# EAGLE design PSU (EAGLE 6.3)
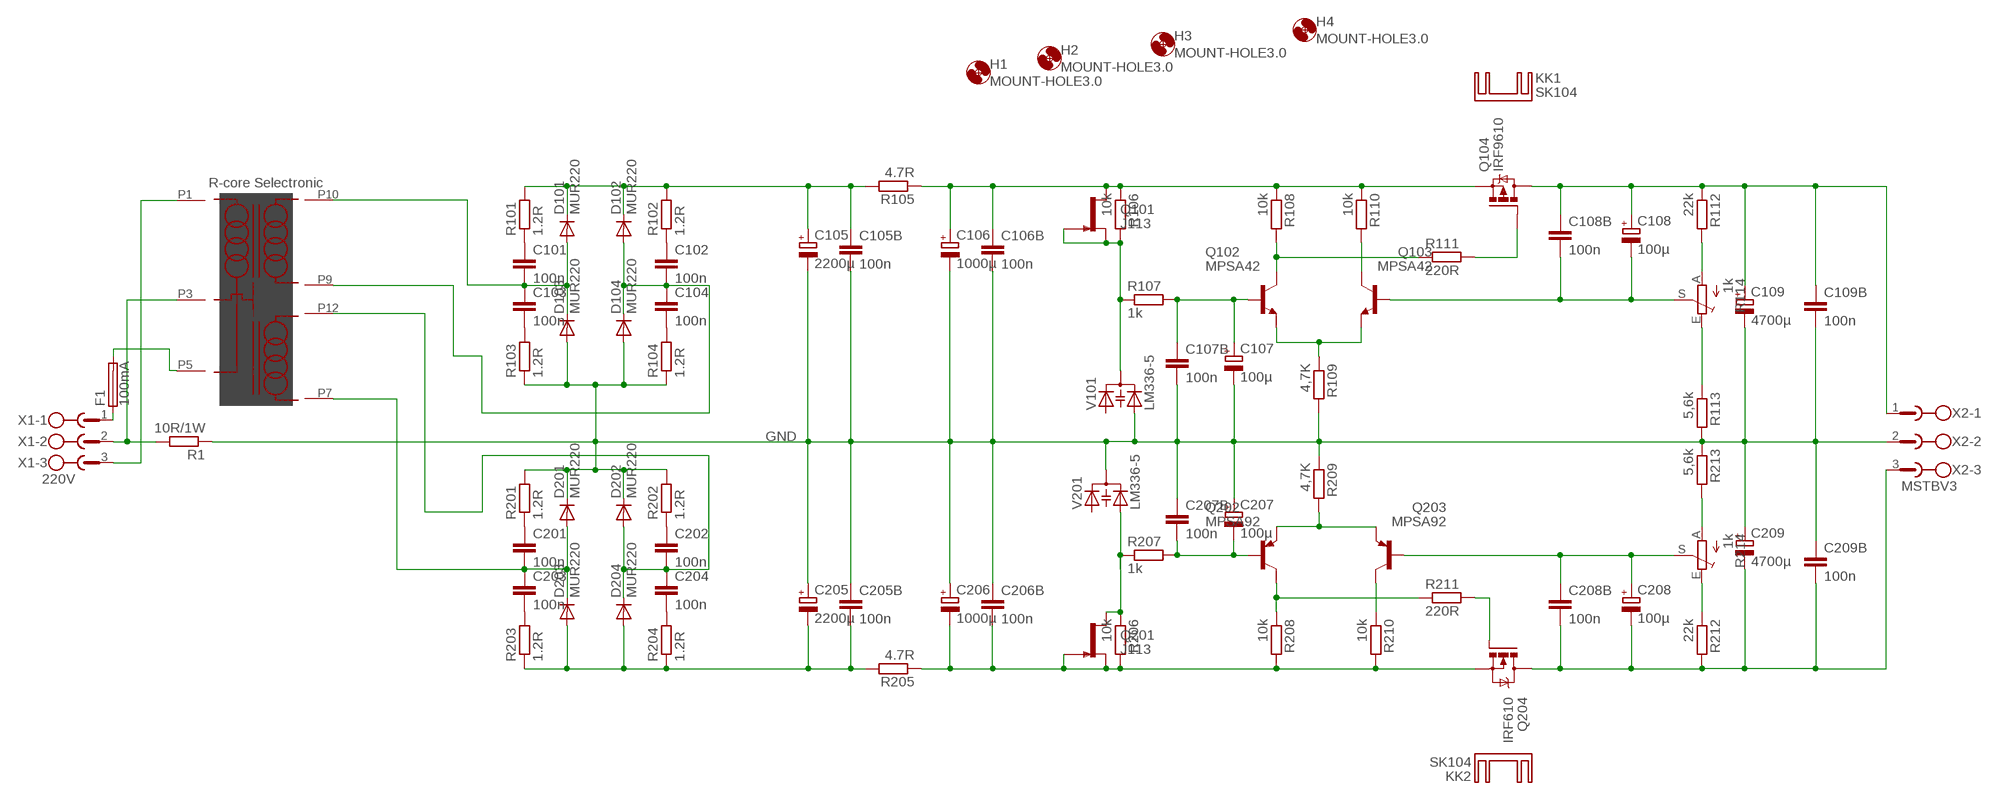
[diagram p0: schematic, sheet 1]

## Parts
C101  100n  C-EU050-025X075  [C050-025X075]
C102  100n  C-EU050-025X075  [C050-025X075]
C103  100n  C-EU050-025X075  [C050-025X075]
C104  100n  C-EU050-025X075  [C050-025X075]
C105  2200µ  CPOL-EUE7.5-16  [E7,5-16]
C105B  100n  C-EU050-025X075  [C050-025X075]
C106  1000µ  CPOL-EUE7.5-16  [E7,5-16]
C106B  100n  C-EU050-025X075  [C050-025X075]
C107  100µ  CPOL-EUE5-10.5  [E5-10,5]
C107B  100n  C-EU050-025X075  [C050-025X075]
C108  100µ  CPOL-EUE5-10.5  [E5-10,5]
C108B  100n  C-EU050-025X075  [C050-025X075]
C109  4700µ  CPOL-EUE10-25  [EB25D]
C109B  100n  C-EU050-025X075  [C050-025X075]
C201  100n  C-EU050-025X075  [C050-025X075]
C202  100n  C-EU050-025X075  [C050-025X075]
C203  100n  C-EU050-025X075  [C050-025X075]
C204  100n  C-EU050-025X075  [C050-025X075]
C205  2200µ  CPOL-EUE7.5-16  [E7,5-16]
C205B  100n  C-EU050-025X075  [C050-025X075]
C206  1000µ  CPOL-EUE7.5-16  [E7,5-16]
C206B  100n  C-EU050-025X075  [C050-025X075]
C207  100µ  CPOL-EUE5-10.5  [E5-10,5]
C207B  100n  C-EU050-025X075  [C050-025X075]
C208  100µ  CPOL-EUE5-10.5  [E5-10,5]
C208B  100n  C-EU050-025X075  [C050-025X075]
C209  4700µ  CPOL-EUE10-25  [EB25D]
C209B  100n  C-EU050-025X075  [C050-025X075]
D101  MUR220  BY500  [DO201-15]
D102  MUR220  BY500  [DO201-15]
D103  MUR220  BY500  [DO201-15]
D104  MUR220  BY500  [DO201-15]
D201  MUR220  BY500  [DO201-15]
D202  MUR220  BY500  [DO201-15]
D203  MUR220  BY500  [DO201-15]
D204  MUR220  BY500  [DO201-15]
F1  100mA  GSH15  [GSH15]
H1  MOUNT-HOLE3.0  [3,0]
H2  MOUNT-HOLE3.0  [3,0]
H3  MOUNT-HOLE3.0  [3,0]
H4  MOUNT-HOLE3.0  [3,0]
KK1  SK104  [SK104]
KK2  SK104  [SK104]
Q101  J113  2N5458  [TO-92]
Q102  MPSA42  -NPN-TO92-EBC  [TO92-EBC]
Q103  MPSA42  -NPN-TO92-EBC  [TO92-EBC]
Q104  IRF9610  IRF9530  [TO220BV]
Q201  J113  2N5458  [TO-92]
Q202  MPSA92  BCX58-PNP-TO92-EBC  [TO92-EBC]
Q203  MPSA92  BCX58-PNP-TO92-EBC  [TO92-EBC]
Q204  IRF610  IRF740  [TO220BV]
R1  10R/1W  R-EU_0613/15  [P0613/15]
R101  1.2R  R-EU_0207/10  [0207/10]
R102  1.2R  R-EU_0207/10  [0207/10]
R103  1.2R  R-EU_0207/10  [0207/10]
R104  1.2R  R-EU_0207/10  [0207/10]
R105  4.7R  R-EU_0207/10  [0207/10]
R106  10k  R-EU_0207/10  [0207/10]
R107  1k  R-EU_0207/10  [0207/10]
R108  10k  R-EU_0207/10  [0207/10]
R109  4,7K  R-EU_0207/10  [0207/10]
R110  10k  R-EU_0207/10  [0207/10]
R111  220R  R-EU_0207/10  [0207/10]
R112  22k  R-EU_0207/10  [0207/10]
R113  5,6k  R-EU_0207/10  [0207/10]
R114  1k  TRIM_EU-S64W  [S64W]
R201  1.2R  R-EU_0207/10  [0207/10]
R202  1.2R  R-EU_0207/10  [0207/10]
R203  1.2R  R-EU_0207/10  [0207/10]
R204  1.2R  R-EU_0207/10  [0207/10]
R205  4.7R  R-EU_0207/10  [0207/10]
R206  10k  R-EU_0207/10  [0207/10]
R207  1k  R-EU_0207/10  [0207/10]
R208  10k  R-EU_0207/10  [0207/10]
R209  4,7K  R-EU_0207/10  [0207/10]
R210  10k  R-EU_0207/10  [0207/10]
R211  220R  R-EU_0207/10  [0207/10]
R212  22k  R-EU_0207/10  [0207/10]
R213  5,6k  R-EU_0207/10  [0207/10]
R214  1k  TRIM_EU-S64W  [S64W]
U$1  R-CORE-SELECTRONIC-PCB  [R-CORE48MM]
V101  LM336-5  DIODE-2CAPACITANCESOT54E  [SOT54E]
V201  LM336-5  DIODE-2CAPACITANCESOT54E  [SOT54E]
X1  220V  MSTBV3  [MSTBV3]
X2  MSTBV3  [MSTBV3]

## Nets
GND [power]: C105.- C105B.2 C106.- C106B.2 C107.- C107B.2 C109.- C109B.2 C205.+ C205B.1 C206.+ C206B.1 C207.+ C207B.1 C209.+ C209B.1 D103.A D104.A D201.C D202.C R1.1 R103.1 R104.1 R109.2 R113.2 R201.2 R202.2 R209.1 R213.1 V101.A2 V201.C X2.2
N$1 [power]: C101.2 C103.1 D101.A D103.C U$1.P10(SEC2-10)
N$2 [power]: C102.2 C104.1 D102.A D104.C U$1.P9(SEC2-9)
N$3: C102.1 R102.1
N$4: C103.2 R103.2
N$5 [power]: C106.+ C106B.1 Q101.1(D) Q104.S R105.1 R106.1 R108.1 R110.1
N$6: C101.1 R101.1
N$7: C104.2 R104.2
N$8 [power]: C105.+ C105B.1 D101.C D102.C R101.2 R102.2 R105.2
N$9 [power]: C206.- C206B.2 Q201.2(S) Q201.3(G) Q204.S R205.1 R206.2 R208.2 R210.2
N$10 [power]: C201.2 C203.1 D201.A D203.C U$1.P7(SEC1-7)
N$11 [power]: C202.2 C204.1 D202.A D204.C U$1.P12(SEC1-12)
N$12: C201.1 R201.1
N$13: C202.1 R202.1
N$14: C203.2 R203.2
N$15: C204.2 R204.2
N$16 [power]: C208.- C208B.2 C209.- C209B.2 Q204.D R212.2 X2.3
N$17 [power]: C205.- C205B.2 D203.A D204.A R203.1 R204.1 R205.2
N$18 [Mains]: F1.1 X1.1
N$19: Q201.1(D) R206.1 R207.1 V201.A2
N$20: Q104.G R111.2
N$21: Q102.C R108.2 R111.1
N$22: Q202.C R208.1 R211.1
N$23: C107.+ C107B.1 Q102.B R107.2
N$24: C207.- C207B.2 Q202.B R207.2
N$25: Q103.C R110.2
N$26: Q102.E Q103.E R109.1
N$27: Q202.E Q203.E R209.2
N$28: Q203.C R210.1
N$29 [power]: C108.+ C108B.1 C109.+ C109B.1 Q104.D R112.1 X2.1
N$30: Q101.2(S) Q101.3(G) R106.2 R107.1 V101.C
N$31: Q204.G R211.2
N$32: C108.- C108B.2 Q103.B R114.S
N$33: C208.+ C208B.1 Q203.B R214.S
N$34: R112.2 R114.A
N$35: R113.1 R114.E
N$36: R212.1 R214.E
N$37: R213.2 R214.A
N$38 [Mains]: F1.2 U$1.P5(PRIM5)
N$40 [Mains]: U$1.P1(PRIM-1) X1.3
N$41 [power]: R1.2 U$1.P3(SHIELD3) X1.2
Unconnected: V101.A1 V201.A1

## Library data of the parts
C101-C104 C105B C106B C107B C108B C109B C201-C204 C205B C206B C207B C208B C209B = rcl:C-EU: CAPACITOR, European symbol
C105-C109 C205-C209 = rcl:CPOL-EU: POLARIZED CAPACITOR, European symbol
D101-D104 D201-D204 = diode:BY500: DIODE fast recovery diode, 5 A, 800 V
F1 = fuse:GSH15: FUSE HOLDER grid 15mm, 19649 Wickmann; MPN: 64900001039; OC_FARNELL: 1271673; OC_NEWARK: 02P0318
H1-H4 = holes:MOUNT-HOLE: MOUNTING HOLE with drill center marker
KK1 KK2 = heatsink:SK104: HEATSINK manufacturer Fischer/distributor Buerklin
Q101 Q201 = 00_steve:2N5458
Q102 Q103 = transistor:*-NPN-: NPN Transistror BF959 corrected 2008.03.06
Q104 = transistor-power:IRF9530: P-CHANNEL HEXFET POWER-MOS-FET Source: http://www.irf.com/product-info/datasheets/data/irf9530.pdf
Q202 Q203 = transistor:*-PNP-: PNP Transistror
Q204 = transistor-power:IRF740: N-CHANNEL MOS FET
R1 R101-R113 R201-R213 = rcl:R-EU_: RESISTOR, European symbol
R114 R214 = pot:TRIM_EU-: POTENTIOMETER
U$1 = gael:R-CORE-SELECTRONIC-PCB: Transformateurs R-core pour PCB vendus par Selectronic (GAJ)
V101 V201 = diode:DIODE-2CAPACITANCE: Capacity DIODE variable-capacitance diode (Infineon)
X1 X2 = con-phoenix-508:MSTBV3: PHOENIX; MPN: MSTBV 2,5/3-GF-5.08; OC_FARNELL: 1792793; OC_NEWARK: 69R9846

## Net classes
0 default: width 0.508 mm, clearance 0.203 mm
1 Mains: width 1.016 mm, clearance 2.5 mm
2 power: width 0.508 mm, clearance 0.203 mm

## Board
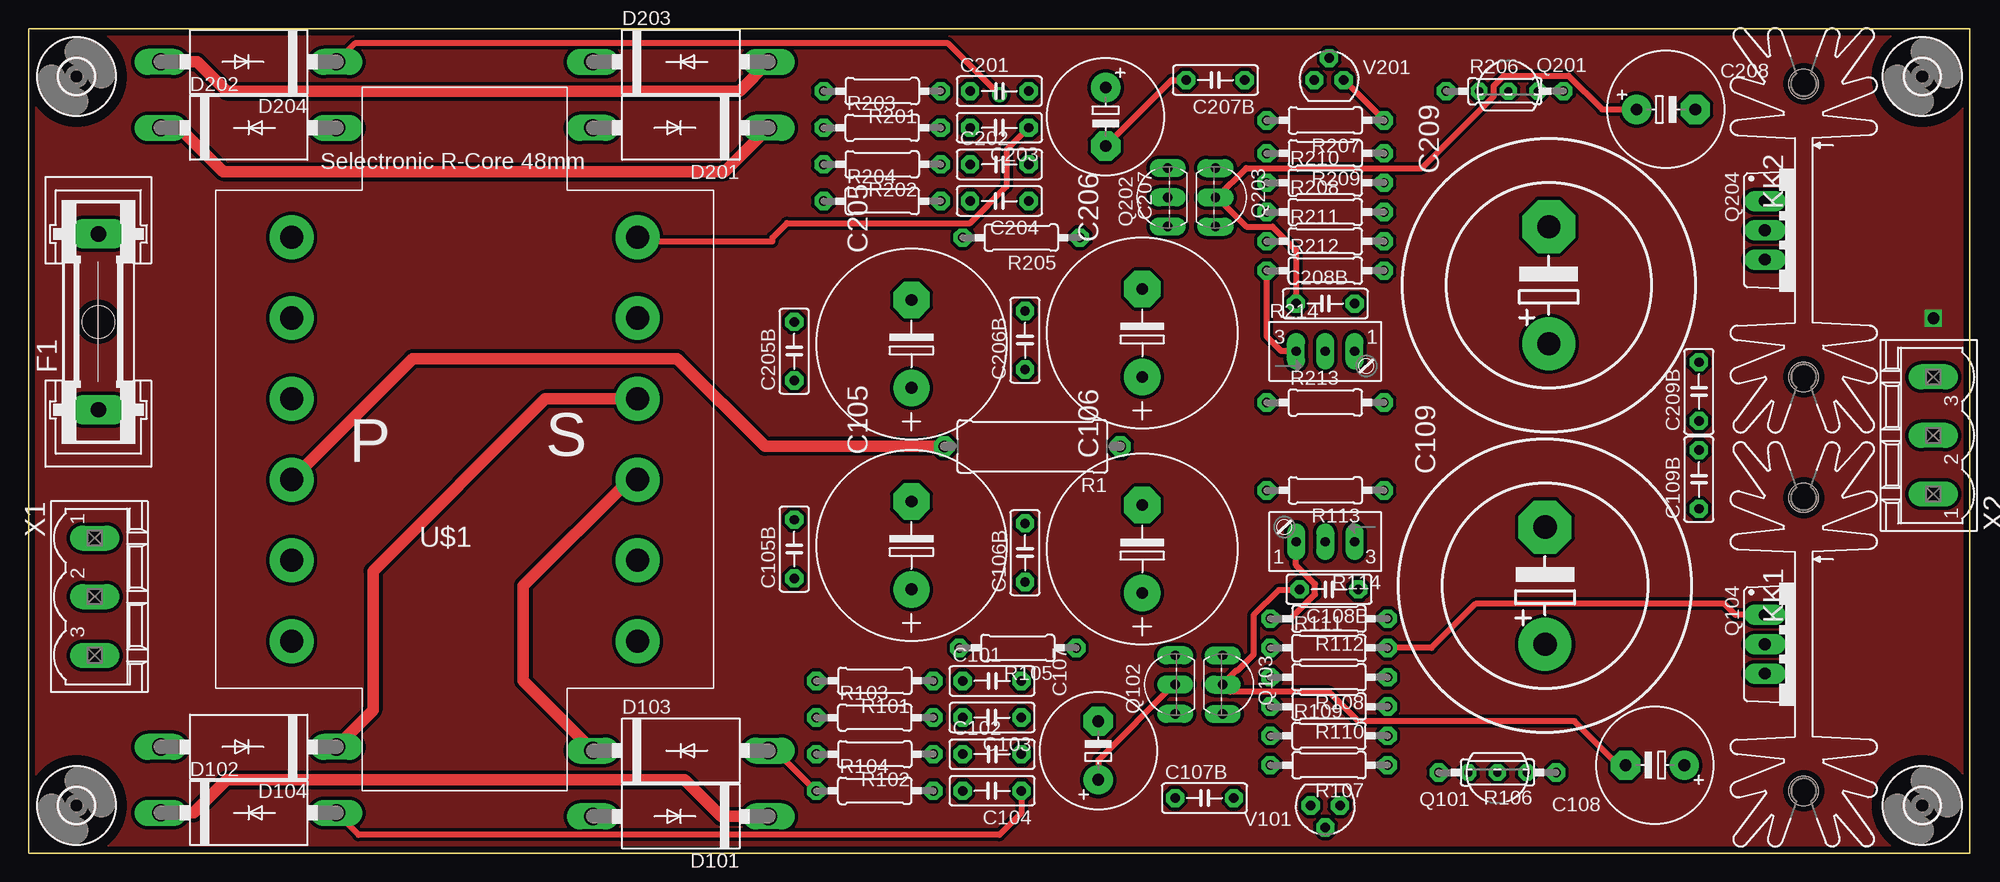
[diagram p1: board, top side]
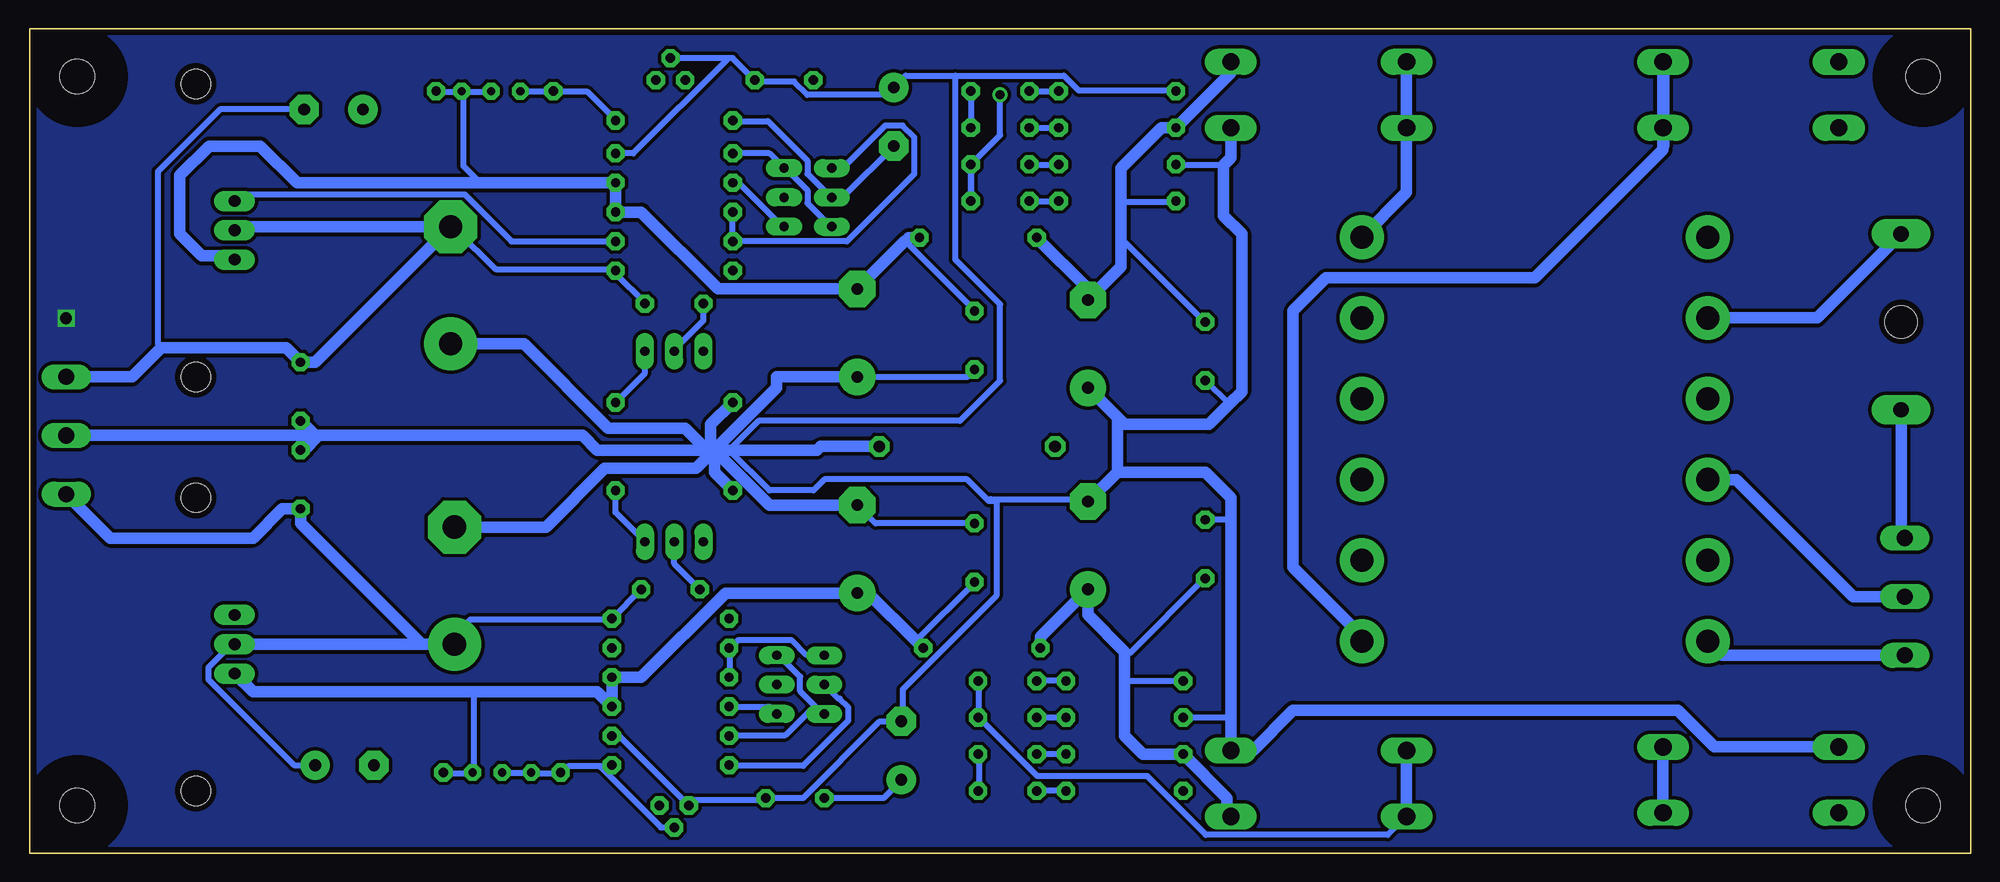
[diagram p2: board, bottom side, seen from below]

Size 168.28 x 71.44 mm. Coordinates in mm from the lower left corner, seen from the top.
Outline: 168.28,0 0,0 0,71.44 168.28,71.44 168.28,0
Copper layers (1*16): Top 0.035mm / dielectric 1.5mm / Bottom 0.035mm
Design rules "gael design rules": minimum track width 12mil, minimum drill 24mil, track to track 8mil, track to pad 8mil, pad to pad 8mil, via to via 8mil, smd to smd 8mil, copper to edge 20mil, drill to drill 8mil, minimum pad ring 15mil, minimum via ring 10mil, stop-mask expansion 4mil, vias tented up to drill 0mil, thermal gap 10mil

### Footprints (pad centres in the part's own frame; a part is rotated, then mirrored left to right if it is on the bottom)
C050-025X075 = drill 0.813 octagon: 1 -2.54,0; 2 2.54,0
E7,5-16 = drill 1.016 pad 3.15: + -3.81,0 | drill 1.016 pad 3.15 octagon: - 3.81,0
E5-10,5 = drill 1.016 pad 2.54: + -2.54,0 | drill 1.016 pad 2.54 octagon: - 2.54,0
EB25D = drill 2.007 pad 4.597: + -5.08,0 | drill 2.007 pad 4.597 octagon: - 5.08,0
DO201-15 = drill 1.499 long: A 7.62,0; C -7.62,0
GSH15 = drill 1.321 pad 2.54 long: 1 -7.62,0; 2 7.62,0 | hole 2.794: 0,0
3,0 = hole 3: 0,0
SK104 = hole 2.54: -12.7,-0.762; 12.7,-0.762
TO-92 = drill 0.7 octagon: 1 -2.54,0; 2 0,0; 3 2.54,0
TO92-EBC = drill 0.813 long: B 0,-1.27; C 2.54,-1.27; E -2.54,-1.27
TO220BV = drill 1.016 long: D 0,-2.54; G -2.54,-2.54; S 2.54,-2.54
P0613/15 = drill 1.016 octagon: 1 -7.62,0; 2 7.62,0
0207/10 = drill 0.813 octagon: 1 -5.08,0; 2 5.08,0
S64W = drill 0.813 long: A 2.54,1.27; E -2.54,1.27; S 0,1.27
R-CORE48MM = drill 2 pad 3.81: P1 -15,-17.5; P2 -15,-10.5; P3 -15,-3.5; P4 -15,3.5; P5 -15,10.5; P6 -15,17.5; P7 15,17.5; P8 15,10.5; P9 15,3.5; P10 15,-3.5; P11 15,-10.5; P12 15,-17.5
SOT54E = drill 0.813 octagon: A1 -1.27,0; A2 1.27,0; C 0,1.905
MSTBV3 = drill 1.397 long: 1 -5.08,0; 2 0,0; 3 5.08,0

### Placement (x,y rotation side)
C101  83.5,14.92 0 top
C102  83.5,8.57 0 top
C103  83.5,11.75 180 top
C104  83.5,5.4 180 top
C105  76.52,26.67 90 top
C105B  66.36,26.35 90 top
C106  96.52,26.35 90 top
C106B  86.36,26.04 90 top
C107  92.71,8.89 90 top
C107B  101.92,4.76 0 top
C108  140.97,7.62 180 top
C108B  112.71,22.86 180 top
C109  131.44,23.18 90 top
C109B  144.78,32.38 90 top
C201  84.14,66.04 0 top
C202  84.14,59.69 0 top
C203  84.14,62.87 180 top
C204  84.14,56.52 180 top
C205  76.52,44.13 90 top
C205B  66.36,43.5 90 top
C206  96.52,45.09 90 top
C206B  86.36,44.45 90 top
C207  93.34,63.82 270 top
C207B  102.87,66.99 180 top
C208  141.92,64.45 0 top
C208B  112.39,47.62 0 top
C209  131.76,49.21 90 top
C209B  144.78,40.01 90 top
D101  56.52,3.17 180 top
D102  19.05,3.49 0 top
D103  56.52,8.89 0 top
D104  19.05,9.21 180 top
D201  56.52,62.87 180 top
D202  19.05,62.87 0 top
D203  56.52,68.58 0 top
D204  19.05,68.58 180 top
F1  6.03,46.04 90 top
H1  164.15,67.31 180 top
H2  4.13,4.13 180 top
H3  4.13,67.31 180 top
H4  164.15,4.13 180 top
KK1  154.62,18.1 270 top
KK2  154.62,53.98 270 top
Q101  127.32,6.99 180 top
Q102  98.11,14.61 90 top
Q103  104.78,14.61 270 top
Q104  153.03,18.1 270 top
Q201  128.27,66.04 0 top
Q202  97.47,56.83 90 top
Q203  104.14,56.83 270 top
Q204  153.03,53.98 270 top
R1  87,35.24 180 top
R101  73.34,14.92 180 top
R102  73.34,8.57 180 top
R103  73.34,11.75 0 top
R104  73.34,5.4 0 top
R105  85.72,17.78 180 top
R106  127.32,6.99 180 top
R107  112.71,7.62 180 top
R108  112.71,15.24 180 top
R109  112.71,10.16 0 top
R110  112.71,12.7 180 top
R111  112.71,17.78 0 top
R112  112.71,20.32 180 top
R113  112.39,31.43 180 top
R114  112.39,28.26 180 top
R201  73.98,66.04 180 top
R202  73.98,59.69 180 top
R203  73.98,62.87 0 top
R204  73.98,56.52 0 top
R205  86.04,53.34 180 top
R206  127.95,66.04 0 top
R207  112.39,63.5 180 top
R208  112.39,55.56 0 top
R209  112.39,60.64 180 top
R210  112.39,58.1 0 top
R211  112.39,53.02 0 top
R212  112.39,50.48 0 top
R213  112.39,39.05 0 top
R214  112.39,42.23 0 top
U$1  37.78,35.88 0 top
V101  112.39,4.13 180 top
V201  112.71,66.99 0 top
X1  5.71,22.23 270 top
X2  165.1,36.2 90 top

### Tracks (layer width: path | path; a pad name or v marks a point on that pad's centre or on a via)
GND
  Top 0.508: R104.1 68.2,5.4 64.52,9.08 D103.A
  Top 1.016: D103.A 63.18,8.89 | D201.C 60.33,59.05 16.83,59.05 13.08,62.8 11.43,62.8 D202.C
  Bottom 0.508: 88.01,67.37 92.33,67.37 C207.+ | 88.01,67.37 78.61,67.37 77.34,66.1 68.96,66.1 R201.2 | C207.+ 93.98,65.72 | 64.77,59.63 68.83,59.63 R202.2 | 64.26,38.92 66.29,40.96 C205B.1 | 64.14,28.89 C105B.2 | 64.14,11.75 R103.1 | 88.01,67.37 88.01,51.44 84.14,47.56 84.14,40.96 87.63,37.47 105.09,37.47 107.63,34.92 104.14,31.43 100.33,31.43 99.38,32.38 87,32.38 85.12,30.51 | 107.82,68.9 107.31,68.9 C207B.1 105.28,66.86 101.98,66.86 100.84,65.72 94.11,65.72 C207.+ | 107.82,68.9 V201.C | R209.1 115.95,60.64 107.82,68.77 107.82,68.9 | R109.2 117.73,10.1 117.09,10.1 V101.A2 111.38,4.64 104.65,4.64 C107B.2 101.22,4.76 94.61,11.37 92.71,11.37 C107.- 92.58,11.62 92.58,14.16 84.45,22.29 84.45,30.48 85.12,30.51 | 96.2,30.48 C106.- 94.93,28.57 C106B.2 | C206.+ 87,41.27 C206B.1 | 11.43,62.8 D202.C | C105.- 76.96,30.67 84.96,30.67 85.12,30.51
  Bottom 1.016: 143.51,36.2 143.19,36.2 | 143.19,36.2 120.33,36.2 119.06,34.92 109.54,34.92 | C106.- 104.14,30.16 108.9,34.92 | C206.+ 103.5,41.27 103.5,40.32 108.58,35.24 | C109B.2 144.46,34.92 143.19,36.2 | C209B.1 143.51,36.2 | C109.- 123.51,28.26 118.43,33.34 110.49,33.34 109.54,34.29 109.54,34.92 | C209.+ 125.41,44.13 118.11,36.83 111.44,36.83 109.54,34.92 | 73.98,33.02 66.36,33.02 64.14,30.8 64.14,28.89 64.14,11.75 D103.A 62.23,8.89 58.74,12.38 25.4,12.38 22.23,9.21 D104.A | 73.98,37.78 73.34,37.15 66.04,37.15 64.26,38.92 63.18,40.01 63.18,53.66 64.77,55.24 64.77,59.63 64.14,60.26 D201.C | 73.98,37.78 C205.+ | X2.2 143.51,36.2 | 73.98,33.02 73.98,37.78 | C105.- 73.98,33.02 | 109.54,34.92 109.22,34.92 | R113.2 108.9,33.02 108.9,34.61 109.06,34.77 | 109.06,34.77 109.22,34.92 | 109.22,34.92 109.22,35.24 | 109.22,35.24 109.22,37.15 R213.1 | 108.58,35.24 108.9,34.92 | 108.9,34.92 109.06,34.77 | 107.63,34.92 108.27,34.92 108.58,35.24 | R1.1 99.69,35.24 100.01,34.92 108.9,34.92 | 108.9,34.92 109.22,35.24
GND2  (via drill 1)
  other vias: 165.1,46.35
  pour Bottom (isolate 0.305): 167.96,0.32 0.32,0.32 0.32,71.12 167.96,71.12
  pour Top (isolate 0.305): 167.96,0.32 0.32,0.32 0.32,71.12 167.96,71.12
N$1
  Top 1.016: U$1.P10 52.06,32.38 42.86,23.18 42.86,14.92 D103.C
  Bottom 0.508: C101.2 85.98,14.92 85.98,11.75 C103.1 85.85,11.62 80.9,6.67 71.37,6.67 66.29,1.59 50.55,1.59 49.28,2.86 D101.A
  Bottom 1.016: D101.A D103.C
N$2
  Top 0.508: C104.1 86.04,3.49 84.14,1.59 28.57,1.59 D102.A
  Top 1.016: U$1.P9 44.77,39.38 29.84,24.45 29.84,12.38 D104.C
  Bottom 0.508: 85.98,5.46 85.98,5.4 C104.1 85.98,5.46 | C102.2 85.98,8.57 85.98,5.46
  Bottom 1.016: D102.A D104.C
N$3
  Bottom 0.508: R102.1 C102.1
N$4
  Bottom 0.508: R103.2 C103.2
N$5
  Bottom 0.508: 91.41,18.38 86.36,23.43 C106B.1 | R106.1 132.33,6.92 129.92,6.92 Q101.1 129.79,7.18 129.79,13.97
  Bottom 1.016: R105.1 91.41,18.38 95.57,22.54 C106.+ 107.95,22.54 115.25,15.24 R108.1 R110.1 119.06,13.97 129.79,13.97 148.91,13.97 Q104.S
N$6
  Bottom 0.508: R101.1 C101.1
N$7
  Bottom 0.508: R104.2 C104.2
N$8
  Top 1.016: D102.C 14.29,3.49 17.14,6.35 56.83,6.35 60.01,3.17 D101.C
  Bottom 0.508: C105B.1 66.42,23.81 72.9,17.34 73.34,17.34 | 73.34,14.92 R101.2
  Bottom 1.016: R105.2 80.64,18.73 C105.+ 76.52,20.64 73.34,17.46 73.34,17.34 73.34,14.92 73.34,10.16 71.75,8.57 R102.2 64.45,4.76 64.45,3.49 D101.C 62.55,3.17
N$9
  Bottom 0.508: 92.36,53.05 86.36,47.05 C206B.2 | Q201.3 130.81,65.98 132.97,65.98 R206.2 | Q201.2 128.27,65.98 130.68,65.98 Q201.3 | Q201.3 130.68,65.72 130.68,59.56 129.22,58.1
  Bottom 1.016: R205.1 92.08,53.34 92.36,53.05 C206.- 108.58,48.9 115.25,55.56 R208.2 R210.2 129.22,58.1 145.1,58.1 148.27,61.28 152.72,61.28 155.26,58.74 155.26,53.66 153.35,51.75 150.81,51.75 Q204.S
N$10
  Top 0.508: C203.1 84.77,60.96 84.77,57.78 81.6,54.61 65.72,54.61 64.45,53.34 64.45,53.02 53.02,53.02 U$1.P7
  Bottom 0.508: C201.2 86.61,65.98 86.61,62.93 C203.1
  Bottom 1.016: D203.C D201.A 48.9,57.27 U$1.P7
N$11  (via drill 0.8)
  Top 0.508: D204.C 28.26,70.17 79.69,70.17 v84.14,65.72
  Bottom 0.508: C202.2 86.61,59.63 86.61,56.58 C204.1 | C204.1 C202.2 | 86.61,56.33 C204.1 | 37.78,49.85 26.35,61.28 26.35,68.58 | v84.14,65.72 84.14,62.23 C202.2
  Bottom 1.016: D204.C D202.A 26.67,60.96 37.78,49.85 55.88,49.85 58.74,46.99 58.74,24.77 52.78,18.81 U$1.P12
N$12
  Bottom 0.508: C201.1 81.53,65.98 79.12,65.98 R201.1
N$13
  Bottom 0.508: C202.1 81.53,59.63 79.12,59.63 R202.1
N$14
  Bottom 0.508: C203.2 81.53,62.8 79.12,62.8 R203.2
N$15
  Bottom 0.508: C204.2 81.53,56.45 79.12,56.45 R204.2
N$16
  Bottom 0.508: C208.- 151.76,64.45 157.16,59.05 157.16,44.13 156.84,43.81 | C208B.2 114.94,47.69 117.47,50.23 R212.2 117.6,50.61 127.89,50.61 131.32,54.04 C209.-
  Bottom 1.016: X2.3 159.38,41.27 156.84,43.81 146.05,43.81 C209B.2 143.51,42.55 C209.- 150.18,54.29 Q204.D
N$17
  Top 1.016: D204.A 14.61,68.58 17.14,66.04 61.59,66.04 D203.A
  Bottom 0.508: 73.66,56.45 68.96,56.45 R204.1 | C205B.2 66.42,46.04 73.28,52.9 73.66,52.9
  Bottom 1.016: R205.2 76.52,48.9 C205.- 73.66,50.8 73.66,52.9 73.66,56.45 73.66,59.37 70.17,62.87 R203.1 64.14,67.63 D203.A
N$18
  Bottom 1.016: X1.1 6.03,27.94 F1.1
N$19
  Top 0.508: V201.A2 114.05,66.99 117.47,63.56 R207.1
  Bottom 0.508: Q201.1 125.73,65.98 122.94,65.98 R206.1 122.68,65.98 119.89,65.98 117.47,63.56 R207.1
N$20
  Top 0.508: Q104.G 147.96,20.64 147,21.59 125.41,21.59 121.6,17.78 R111.2
N$21
  Bottom 0.508: Q102.C 99.44,17.21 100.97,17.21 102.23,18.48 106.81,18.48 107.44,17.84 R111.1 107.57,17.72 107.57,15.3 R108.2
N$22
  Bottom 0.508: Q202.C 97.79,59.37 94.11,63.06 92.58,63.06 91.57,62.04 91.57,58.86 97.41,53.02 R211.1 R208.1
N$23
  Top 0.508: C107.+ 92.71,8.06 99.31,14.67 Q102.B
  Bottom 0.508: C107B.1 94.23,4.76 92.71,6.29 C107.+ | Q102.B 98.17,13.4 98.04,13.4 97.28,12.64 97.28,11.49 101.22,7.56 107.57,7.56 R107.2
N$24
  Top 0.508: C207.- 99.06,66.99 C207B.2
  Bottom 0.508: 98.81,56.83 Q202.B | C207.- 97.66,56.96 98.55,56.96 Q202.B | Q202.B 98.93,56.96 100.84,58.86 100.84,60.01 104.27,63.44 107.31,63.44 R207.2
N$25
  Bottom 0.508: R110.2 107.57,12.64 104.01,12.64 103.5,12.13 Q103.C
N$26
  Bottom 0.508: Q102.E 99.44,12 101.47,14.03 101.47,15.3 103.25,17.08 103.5,17.08 Q103.E | 100.33,12.64 Q102.E | Q102.E 100.46,12.51 102.74,10.22 107.57,10.22 R109.1
N$27
  Bottom 0.508: 98.81,54.29 Q202.E 98.93,54.42 100.84,56.33 100.84,57.47 102.74,59.37 Q203.E 104.14,60.64 R209.2
N$28
  Bottom 0.508: R210.1 106.81,58.1 103,54.29 Q203.C
N$29
  Bottom 0.508: C108B.1 R112.1 117.98,20.26 130.05,20.26 131.83,18.48 C109.+ | C108.+ 145.35,7.62 152.78,15.05 152.78,16.07 150.88,17.97 Q104.D
  Bottom 1.016: X2.1 161.29,27.3 148.91,27.3 146.37,29.84 C109B.1 144.78,28.57 134.3,18.1 C109.+ Q104.D
N$30
  Bottom 0.508: Q101.2 127.25,6.92 124.84,6.92 Q101.3 124.59,6.92 122.3,6.92 R106.2 122.05,7.05 121.54,7.56 118.75,7.56 | 118.75,7.56 117.86,7.56 R107.1 | V101.C 113.54,2.22 118.75,7.43 118.75,7.56
N$31
  Bottom 0.508: 149.99,57.09 150.5,56.58 Q204.G 149.86,57.09 130.56,57.09 126.49,53.02 R211.2
N$32
  Top 0.508: C108B.2 110.11,22.8 108.33,22.8 106.17,20.64 106.17,17.21 104.78,15.81 104.65,15.81 103.5,14.67 Q103.B 104.14,13.97 112.71,13.97 115.25,11.43 133.99,11.43 137.79,7.62 C108.-
  Bottom 0.508: R114.S 112.39,25.08 C108B.2
N$33
  Top 0.508: C208.+ 136.4,64.45 133.48,67.37 127.89,67.37 127,66.48 127,65.6 120.78,59.37 105.54,59.37 103,56.83 | C208B.1 109.86,52.26 107.82,54.29 105.54,54.29 103,56.83 | Q203.B 103,56.83
  Bottom 0.508: R214.S 112.39,43.62 109.86,46.16 C208B.1
N$34
  Top 0.508: R114.A 109.86,24.96 111.51,23.3 111.51,22.42 109.47,20.38 107.7,20.38 R112.2
N$35
  Bottom 0.508: R113.1 117.47,29.53 R114.E
N$36
  Top 0.508: R214.E 108.58,43.5 107.31,44.77 R212.1
N$37
  Bottom 0.508: R214.A 114.94,41.59 R213.2
N$38
  Bottom 1.016: U$1.P5 13.31,46.38 F1.2
N$40
  Bottom 1.016: X1.3 21.55,17.14 U$1.P1
N$41
  Top 1.016: U$1.P3 33.27,42.86 56.2,42.86 63.82,35.24 R1.2
  Bottom 1.016: U$1.P3 20.31,32.38 10.16,22.23 X1.2

### Text on the board
Measures: V- | Ph | V+ | Terre | Ntr